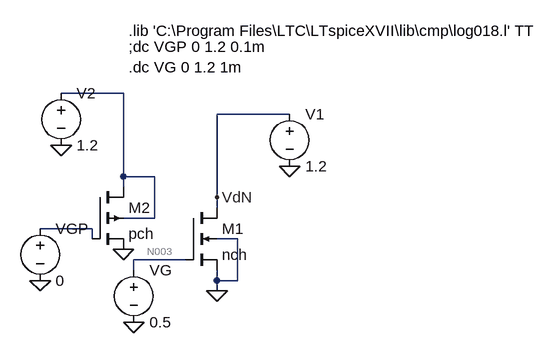
[diagram p0: schematic 5a.asc]
5a.asc, the LTspice schematic file:
Version 4
SHEET 1 880 680
WIRE 32 16 -64 16
WIRE 288 48 176 48
WIRE 32 144 32 16
WIRE 80 144 32 144
WIRE 32 160 32 144
WIRE 176 176 176 48
WIRE 176 192 176 176
WIRE 80 208 80 144
WIRE 80 208 32 208
WIRE -16 224 -96 224
WIRE -16 240 -16 224
WIRE 208 240 176 240
WIRE 128 272 48 272
WIRE 48 288 48 272
WIRE 176 304 176 288
WIRE 208 304 208 240
WIRE 208 304 176 304
WIRE 176 320 176 304
FLAG 288 128 0
FLAG -64 96 0
FLAG 176 320 0
FLAG 32 256 0
FLAG 48 368 0
FLAG -96 304 0
FLAG 176 176 VdN
SYMBOL nmos4 128 192 R0
SYMATTR InstName M1
SYMATTR Value2 l=0.18u w=3u
SYMATTR Value nch
SYMBOL pmos4 -16 160 R0
SYMATTR InstName M2
SYMATTR Value2 l=0.18u w=3u
SYMATTR Value pch
SYMBOL voltage 288 32 R0
WINDOW 123 0 0 Left 0
WINDOW 39 0 0 Left 0
SYMATTR InstName V1
SYMATTR Value 1.2
SYMBOL voltage -64 0 R0
WINDOW 123 0 0 Left 0
WINDOW 39 0 0 Left 0
SYMATTR InstName V2
SYMATTR Value 1.2
SYMBOL voltage 48 272 R0
WINDOW 123 0 0 Left 0
WINDOW 39 0 0 Left 0
SYMATTR InstName VG
SYMATTR Value 0.5
SYMBOL voltage -96 208 R0
WINDOW 123 0 0 Left 0
WINDOW 39 0 0 Left 0
SYMATTR InstName VGP
SYMATTR Value 0
TEXT 40 -24 Left 2 !.dc VG 0 1.2 1m
TEXT 40 -80 Left 2 !.lib 'C:\\Program Files\\LTC\\LTspiceXVII\\lib\\cmp\\log018.l' TT
TEXT 40 -56 Left 2 !;dc VGP 0 1.2 0.1m

The netlist it stands for:
* 5a.asc
M1 VdN N003 0 0 nch l=0.18u w=3u
M2 N001 N002 0 N001 pch l=0.18u w=3u
V1 VdN 0 1.2
V2 N001 0 1.2
VG N003 0 0.5
VGP N002 0 0
.model NMOS NMOS
.model PMOS PMOS
.lib standard.mos
.dc VG 0 1.2 1m
.lib 'C:\Program Files\LTC\LTspiceXVII\lib\cmp\log018.l' TT
;dc VGP 0 1.2 0.1m
.backanno
.end

* Results of the author's LTspice run, read from the files saved beside the schematic
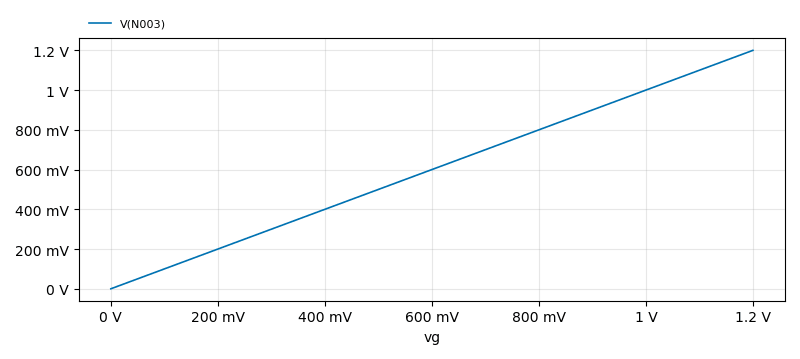
[diagram p1: DC transfer characteristic of 5a.asc, plotted from the saved traces]
* DC transfer characteristic, 1 run:
*   V(N003): 0 V at vg=0 V, 1.2 V at vg=1.2 V, min 0 V, max 1.2 V